# Altium project Dc_motor.PrjPcb
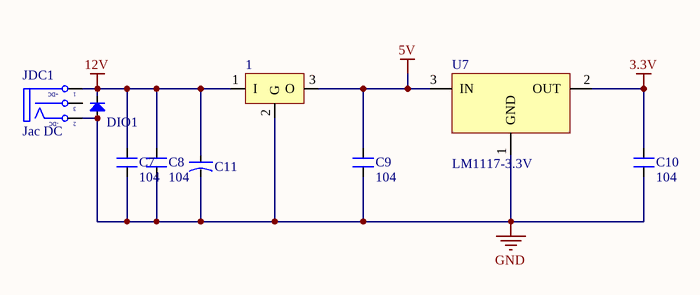
[diagram p0: Power.SchDoc]
3 sheets, 55 parts. Net scope: global (net labels, ports and power ports of the same name join across sheets).
Board file: Dc_motor_pcb.PcbDoc
Sheets:
  Power.SchDoc
  MCU.SchDoc
  Driver.SchDoc

## Sheet Power.SchDoc
size A

### Parts
1  LM78xx  [TO252-123]  (value not drawn)
C7  104  [SM-CAP-0805]
C8  104  [SM-CAP-0805]
C9  104  [SM-CAP-0805]
C10  104  [SM-CAP-0805]
C11  CN-ALU-SMD  [CAP-ALU-SMD-4.5x5x1.4]  (value not drawn)
DIO1  Diode SMD  [DIO-SMD-106]  (value not drawn)
JDC1  Jac DC  [DC3]
U7  LM1117-3.3V  [SOT223]

### Nets
3.3V: C10.2 U7.2(OUT)
5V: 1.3(O) C9.2 U7.3(IN)
12V: 1.1(I) C7.2 C8.2 C11.1 DIO1.2(K) JDC1.1(T)
GND: 1.2(G) C7.1 C8.1 C9.1 C10.1 C11.2 DIO1.1(A) JDC1.2(TN) U7.1(GND)

Not connected (* = marked no-connect by the designer): JDC1 3(S)

### Notes on the sheet
- (in symbol DCIN) +DC; -DC

### Library data of the parts
1 = LM78xx: Positive Voltage Regulator; Note: Tab is connected to pin 3 (GND).; Published: 24-Aug-2001; LatestRevisionDate: 17-Jul-2002; LatestRevisionNote: Re-released for DXP Platform.; DatasheetVersion: Apr-1994; PackageVersion: Jul-1998; PackageReference: ISOWATT220AB; Publisher: Altium Limited; PackageDescription: TO, Thru-Hole, Vertical, Heatsink Mounted; 3 In-Line Leads; Pitch 2.54 mm; Pin sequence 1, 3, 2; ComponentLink1Description: Manufacturer Link; ComponentLink1URL: http://www.st.com/; ComponentLink2Description: Datasheet; ComponentLink2URL: http://www.st.com/stonline/products/literature/ds/2146/l78m05c.pdf
C7-C10 = CN: Value: 0,1uF/300V; Designed by: VanDungEvn
C11 = CN-ALU-SMD: Polarized Capacitor (Axial); Published: 8-Jun-2000; LatestRevisionDate: 17-Jul-2002; LatestRevisionNote: Re-released for DXP Platform.; PackageReference: POLAR0.8; Publisher: Altium Limited
DIO1 = Diode SMD: Default Diode; Code - JEDEC: DO-214-AB; Value: 1N5007; Published: 8-Jun-2000; Revision: July-2002: Re-released for DXP Platform.; Publisher: Altium Limited
JDC1 = DCIN: Jac DC input; Value: Jac DC
U7 = LM1117: 800mA Low-Dropout Linear Regulator; Creator: Nguyen Ba Bien; Website: http://group3i.net

## Sheet MCU.SchDoc
size A
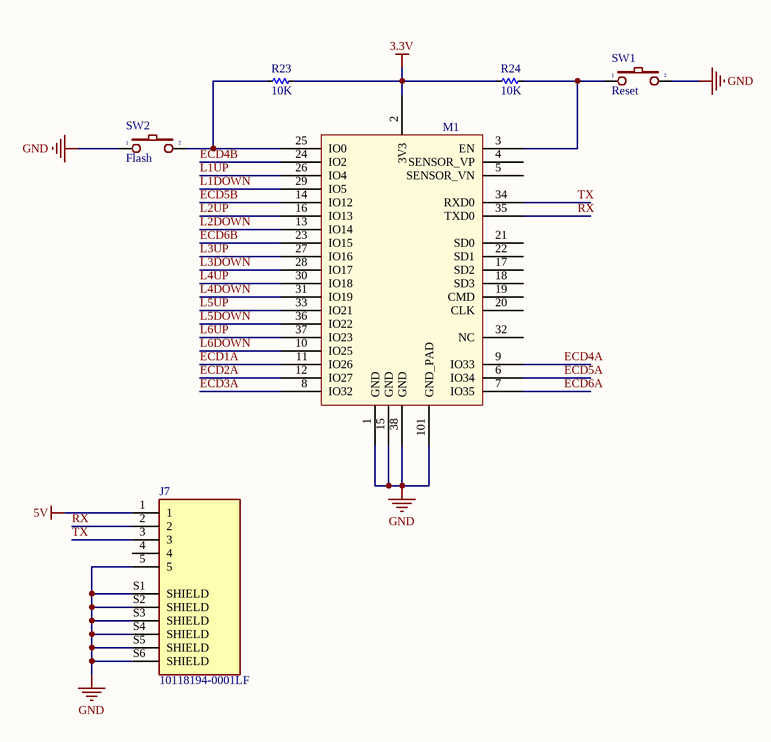
[diagram p1: MCU.SchDoc]

### Parts
J7  10118194-0001LF  [AMPHENOL_10118194-0001LF]
M1  ESP32S_Module  [ESP32S]  (value not drawn)
R23  10K  [RES-SMD-0805]
R24  10K  [RES-SMD-0805]
SW1  Reset  [SW1-SMD]
SW2  Flash  [SW-DIP1-1]

### Nets
3.3V: M1.2(3V3) R23.1 R24.2
5V: J7.1
ECD1A: M1.11(IO26)
ECD2A: M1.12(IO27)
ECD3A: M1.8(IO32)
ECD4A: M1.9(IO33)
ECD4B: M1.24(IO2)
ECD5A: M1.6(IO34)
ECD5B: M1.14(IO12)
ECD6A: M1.7(IO35)
ECD6B: M1.23(IO15)
GND: J7.5 J7.S1(SHIELD) J7.S2(SHIELD) J7.S3(SHIELD) J7.S4(SHIELD) J7.S5(SHIELD) J7.S6(SHIELD) M1.1(GND) M1.15(GND) M1.38(GND) M1.101(GND_PAD) SW1.2 SW2.1
L1DOWN: M1.29(IO5)
L1UP: M1.26(IO4)
L2DOWN: M1.13(IO14)
L2UP: M1.16(IO13)
L3DOWN: M1.28(IO17)
L3UP: M1.27(IO16)
L4DOWN: M1.31(IO19)
L4UP: M1.30(IO18)
L5DOWN: M1.36(IO22)
L5UP: M1.33(IO21)
L6DOWN: M1.10(IO25)
L6UP: M1.37(IO23)
RX: J7.2 M1.35(TXD0)
TX: J7.3 M1.34(RXD0)
NetM1_3: M1.3(EN) R24.1 SW1.1
NetM1_25: M1.25(IO0) R23.2 SW2.2

Not connected (* = marked no-connect by the designer): J7 4; M1 4(SENSOR_VP) 5(SENSOR_VN) 17(SD2) 18(SD3) 19(CMD) 20(CLK) 21(SD0) 22(SD1) 32(NC)

### Library data of the parts
J7 = 10118194-0001LF: USB - micro B USB 2.0 Receptacle Connector 5 Position Surface Mount, Right Angle; Through Hole; MF: Amphenol ICC; Package: None; Price: None; Availability: Unavailable; MP: 10118194-0001LF; SnapEDA_Link: https://www.snapeda.com/parts/10118194-0001LF/Amphenol%20FCI/view-part/1413308/?ref=snap; Value: *
M1 = ESP32S_Module: Esp-32S; Datasheet: https://espressif.com/sites/default/files/documentation/esp_wroom_32_datasheet_en.pdf
R23 R24 = Res-SMD: Resistor; Manufacturer: Generic Components; Class: Passive; Published: 08/06/2000; Publisher: Altium Hobart Technology Centre
SW1 SW2 = SW2: Switch button 2 pin; Value: SW chip 2 pin

## Sheet Driver.SchDoc
size A3
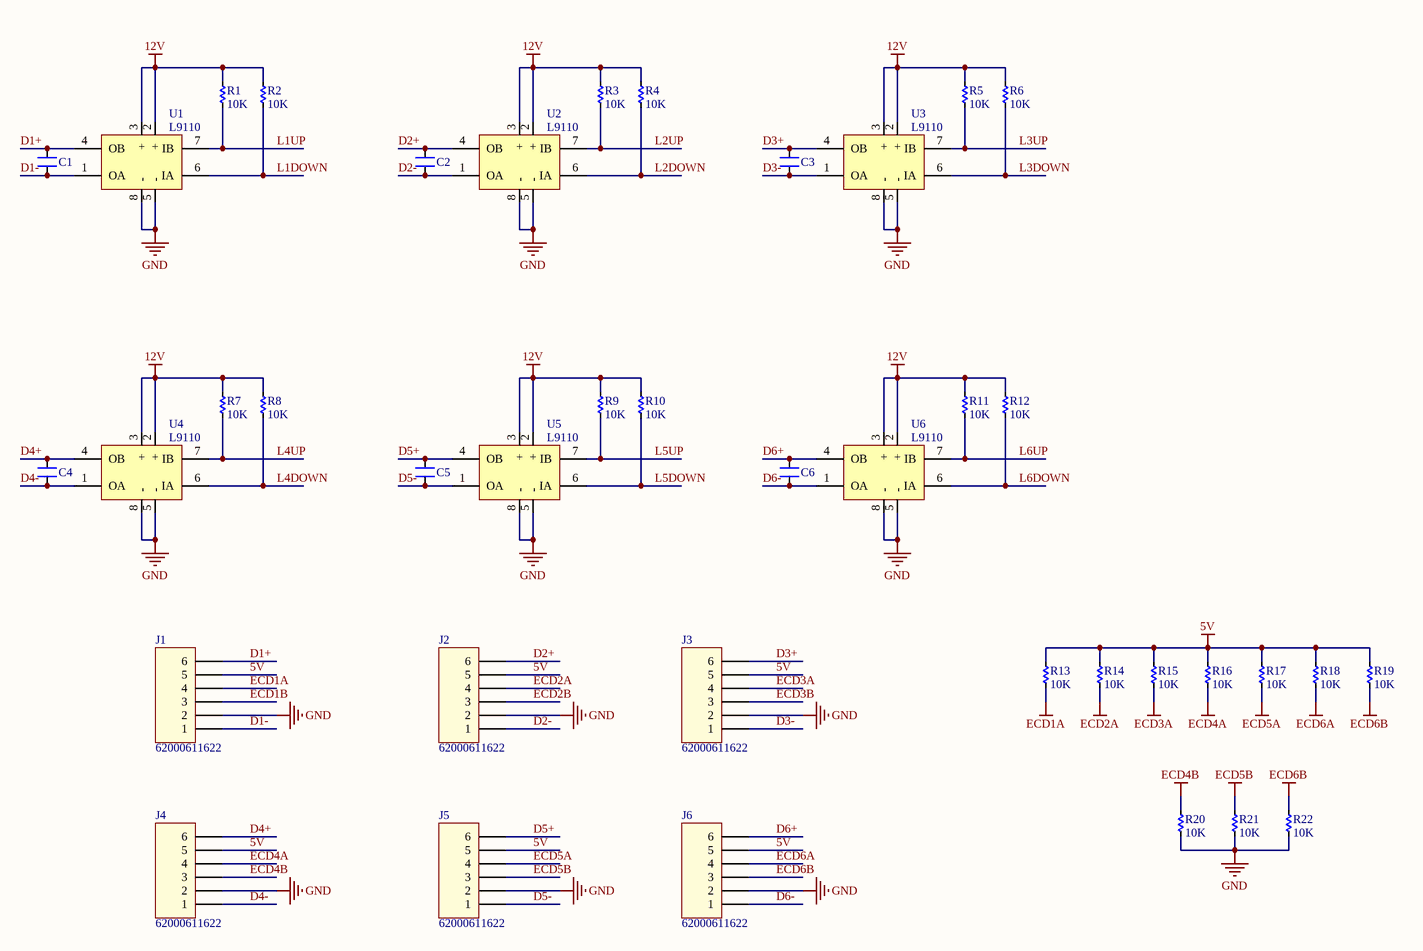
[diagram p2: Driver.SchDoc]

### Parts
C1  XXpF  [CN2-LT]  (value not drawn)
C2  XXpF  [CN2-LT]  (value not drawn)
C3  XXpF  [CN2-LT]  (value not drawn)
C4  XXpF  [CN2-LT]  (value not drawn)
C5  XXpF  [CN2-LT]  (value not drawn)
C6  XXpF  [CN2-LT]  (value not drawn)
J1  62000611622  [62000611622]
J2  62000611622  [62000611622]
J3  62000611622  [62000611622]
J4  62000611622  [62000611622]
J5  62000611622  [62000611622]
J6  62000611622  [62000611622]
R1  10K  [RES-SMD-0805]
R2  10K  [RES-SMD-0805]
R3  10K  [RES-SMD-0805]
R4  10K  [RES-SMD-0805]
R5  10K  [RES-SMD-0805]
R6  10K  [RES-SMD-0805]
R7  10K  [RES-SMD-0805]
R8  10K  [RES-SMD-0805]
R9  10K  [RES-SMD-0805]
R10  10K  [RES-SMD-0805]
R11  10K  [RES-SMD-0805]
R12  10K  [RES-SMD-0805]
R13  10K  [RES-SMD-0805]
R14  10K  [RES-SMD-0805]
R15  10K  [RES-SMD-0805]
R16  10K  [RES-SMD-0805]
R17  10K  [RES-SMD-0805]
R18  10K  [RES-SMD-0805]
R19  10K  [RES-SMD-0805]
R20  10K  [RES-SMD-0805]
R21  10K  [RES-SMD-0805]
R22  10K  [RES-SMD-0805]
U1  L9110  [DIP8]
U2  L9110  [DIP8]
U3  L9110  [DIP8]
U4  L9110  [DIP8]
U5  L9110  [DIP8]
U6  L9110  [DIP8]

### Nets
5V: J1.5 J2.5 J3.5 J4.5 J5.5 J6.5 R13.1 R14.1 R15.1 R16.1 R17.1 R18.1 R19.1
12V: R1.1 R2.1 R3.1 R4.1 R5.1 R6.1 R7.1 R8.1 R9.1 R10.1 R11.1 R12.1 U1.2(+) U1.3(+) U2.2(+) U2.3(+) U3.2(+) U3.3(+) U4.2(+) U4.3(+) U5.2(+) U5.3(+) U6.2(+) U6.3(+)
ECD1A: J1.4 R13.2
ECD2A: J2.4 R14.2
ECD3A: J3.4 R15.2
ECD4A: J4.4 R16.2
ECD4B: J4.3 R20.2
ECD5A: J5.4 R17.2
ECD5B: J5.3 R21.2
ECD6A: J6.4 R18.2
ECD6B: J6.3 R19.2 R22.2
GND: J1.2 J2.2 J3.2 J4.2 J5.2 J6.2 R20.1 R21.1 R22.1 U1.5(-) U1.8(-) U2.5(-) U2.8(-) U3.5(-) U3.8(-) U4.5(-) U4.8(-) U5.5(-) U5.8(-) U6.5(-) U6.8(-)
D1+: C1.2 J1.6 U1.4(OB)
D1-: C1.1 J1.1 U1.1(OA)
D2+: C2.2 J2.6 U2.4(OB)
D2-: C2.1 J2.1 U2.1(OA)
D3+: C3.2 J3.6 U3.4(OB)
D3-: C3.1 J3.1 U3.1(OA)
D4+: C4.2 J4.6 U4.4(OB)
D4-: C4.1 J4.1 U4.1(OA)
D5+: C5.2 J5.6 U5.4(OB)
D5-: C5.1 J5.1 U5.1(OA)
D6+: C6.2 J6.6 U6.4(OB)
D6-: C6.1 J6.1 U6.1(OA)
ECD1B: J1.3
ECD2B: J2.3
ECD3B: J3.3
L1DOWN: R2.2 U1.6(IA)
L1UP: R1.2 U1.7(IB)
L2DOWN: R4.2 U2.6(IA)
L2UP: R3.2 U2.7(IB)
L3DOWN: R6.2 U3.6(IA)
L3UP: R5.2 U3.7(IB)
L4DOWN: R8.2 U4.6(IA)
L4UP: R7.2 U4.7(IB)
L5DOWN: R10.2 U5.6(IA)
L5UP: R9.2 U5.7(IB)
L6DOWN: R12.2 U6.6(IA)
L6UP: R11.2 U6.7(IB)

### Library data of the parts
C1-C6 = CN: Value: 33pF
J1-J6 = 62000611622: WR-WTB 2.00mm Male Vertical Shrouded Header, 6p; Pin Number: 6; ComponentLink1Description: Manufacturer; ComponentLink1URL: http://www.we-online.de; ComponentLink2Description: Datasheet; ComponentLink2URL: http://katalog.we-online.de/em/datasheet/6200xx11622.pdf; Part Number: 62000611622; Published Date: June 2017; Publisher: Wurth Elektronik; Pitch: 2.00 mm
R1-R22 = Res-SMD: as R23 on sheet MCU; Published: 08/06/2000; Publisher: Altium Hobart Technology Centre
U1-U6 = L9110: Half-Bridge Driver

## Nets that join several sheets
3.3V: Power (C10.2 U7.2), MCU (M1.2 R23.1 R24.2)
5V: Power (1.3 C9.2 U7.3), MCU (J7.1), Driver (13 pins)
12V: Power (6 pins), Driver (24 pins)
ECD1A: MCU (M1.11), Driver (J1.4 R13.2)
ECD2A: MCU (M1.12), Driver (J2.4 R14.2)
ECD3A: MCU (M1.8), Driver (J3.4 R15.2)
ECD4A: MCU (M1.9), Driver (J4.4 R16.2)
ECD4B: MCU (M1.24), Driver (J4.3 R20.2)
ECD5A: MCU (M1.6), Driver (J5.4 R17.2)
ECD5B: MCU (M1.14), Driver (J5.3 R21.2)
ECD6A: MCU (M1.7), Driver (J6.4 R18.2)
ECD6B: MCU (M1.23), Driver (J6.3 R19.2 R22.2)
GND: Power (9 pins), MCU (13 pins), Driver (21 pins)
L1DOWN: MCU (M1.29), Driver (R2.2 U1.6)
L1UP: MCU (M1.26), Driver (R1.2 U1.7)
L2DOWN: MCU (M1.13), Driver (R4.2 U2.6)
L2UP: MCU (M1.16), Driver (R3.2 U2.7)
L3DOWN: MCU (M1.28), Driver (R6.2 U3.6)
L3UP: MCU (M1.27), Driver (R5.2 U3.7)
L4DOWN: MCU (M1.31), Driver (R8.2 U4.6)
L4UP: MCU (M1.30), Driver (R7.2 U4.7)
L5DOWN: MCU (M1.36), Driver (R10.2 U5.6)
L5UP: MCU (M1.33), Driver (R9.2 U5.7)
L6DOWN: MCU (M1.10), Driver (R12.2 U6.6)
L6UP: MCU (M1.37), Driver (R11.2 U6.7)